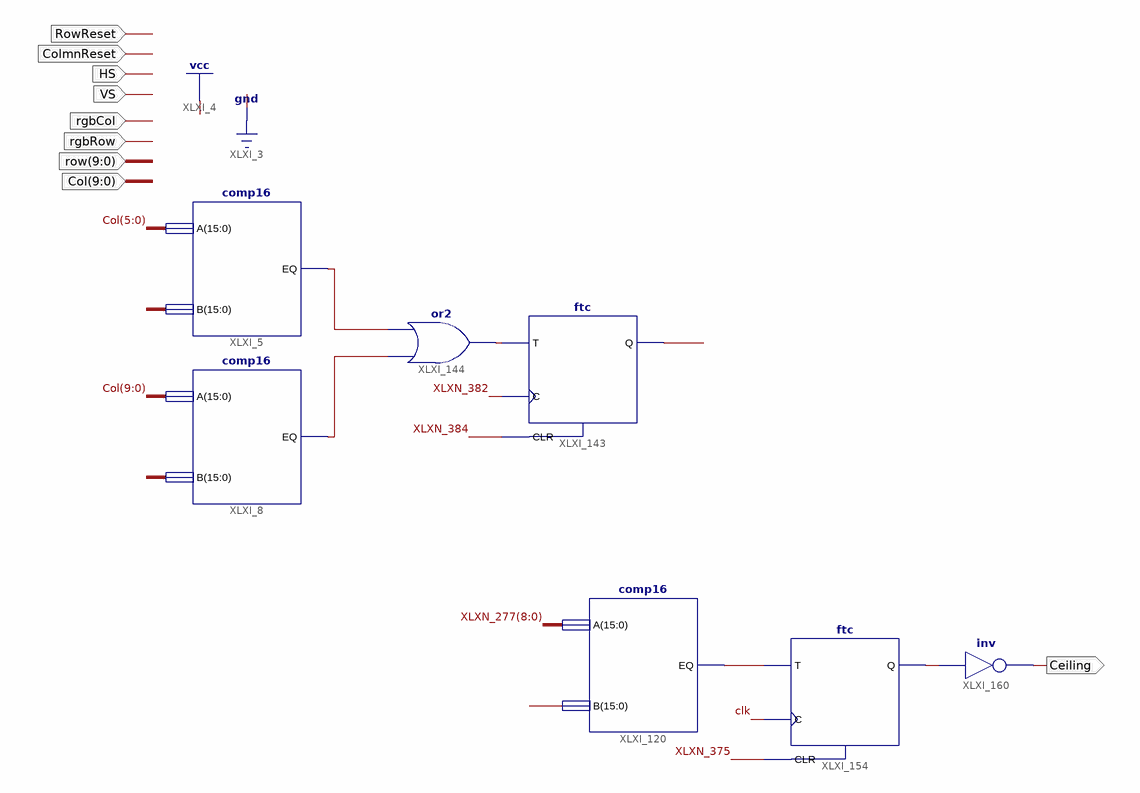
[diagram p0: schematic sheet 1]
// Xilinx ISE schematic Pixel_Manage.sch (spartan3e) as structural Verilog: 7 symbols, 9 ports
module Pixel_Manage (
  input  HS,
  input  VS,
  input  rgbCol,
  input  rgbRow,
  input  [9:0] Col,
  input  RowReset,
  input  ColmnReset,
  input  [9:0] row,
  output Ceiling
);

  wire clk, XLXN_278, XLXN_324, XLXN_332, XLXN_333, XLXN_369, XLXN_371, XLXN_375, XLXN_382, XLXN_384,
       XLXN_385;
  wire [8:0] XLXN_277;

  comp16 XLXI_8 (.A(Col), .B(10'b1001001111), .EQ(XLXN_333));
  comp16 XLXI_5 (.A(Col[5:0]), .B(6'b110000), .EQ(XLXN_332));
  or XLXI_144 (XLXN_324, XLXN_333, XLXN_332);
  ftc XLXI_143 (.C(XLXN_382), .CLR(XLXN_384), .T(XLXN_324), .Q(XLXN_385));
  not XLXI_160 (Ceiling, XLXN_371);
  ftc XLXI_154 (.C(clk), .CLR(XLXN_375), .T(XLXN_369), .Q(XLXN_371));
  comp16 XLXI_120 (.A(XLXN_277), .B({16{XLXN_278}}), .EQ(XLXN_369));
endmodule
